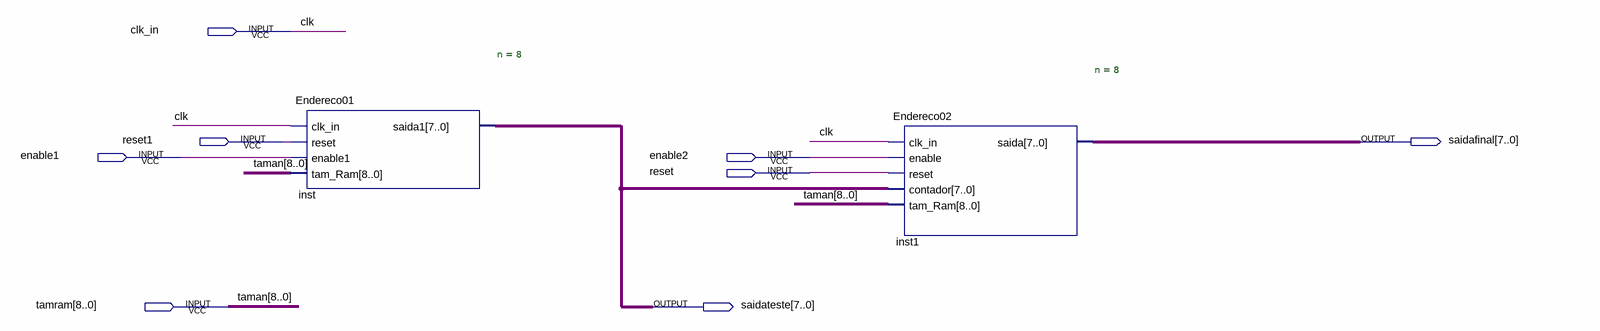
[diagram p0: schematic sheet]
// Quartus schematic Endereco_Ram.bdf as structural Verilog: 2 symbols, 8 pins
module Endereco_Ram (
  input  clk_in,
  input  reset1,
  input  enable1,
  input  enable2,
  input  reset,
  input  [8:0] tamram,
  output [7:0] saidafinal,
  output [7:0] saidateste
);

  Endereco01 #(.n(8)) inst (.clk_in(clk_in), .reset(reset1), .enable1(enable1), .tam_Ram(tamram), .saida1(saidateste));
  Endereco02 #(.n(8)) inst1 (
    .clk_in(clk_in), .enable(enable2), .reset(reset), .contador(saidateste), .tam_Ram(tamram),
    .saida(saidafinal));

  // Other names for the same wires on the sheet: clk = clk_in; taman[8:0] = tamram
endmodule
